# Altium schematic sheet Solar_950_VDC_Standby_PS.SchDoc
size A1; SPICEModelCacheYQEDCYZF: <root> / <DocumentId>YQEDCYZF</DocumentId> / </root>
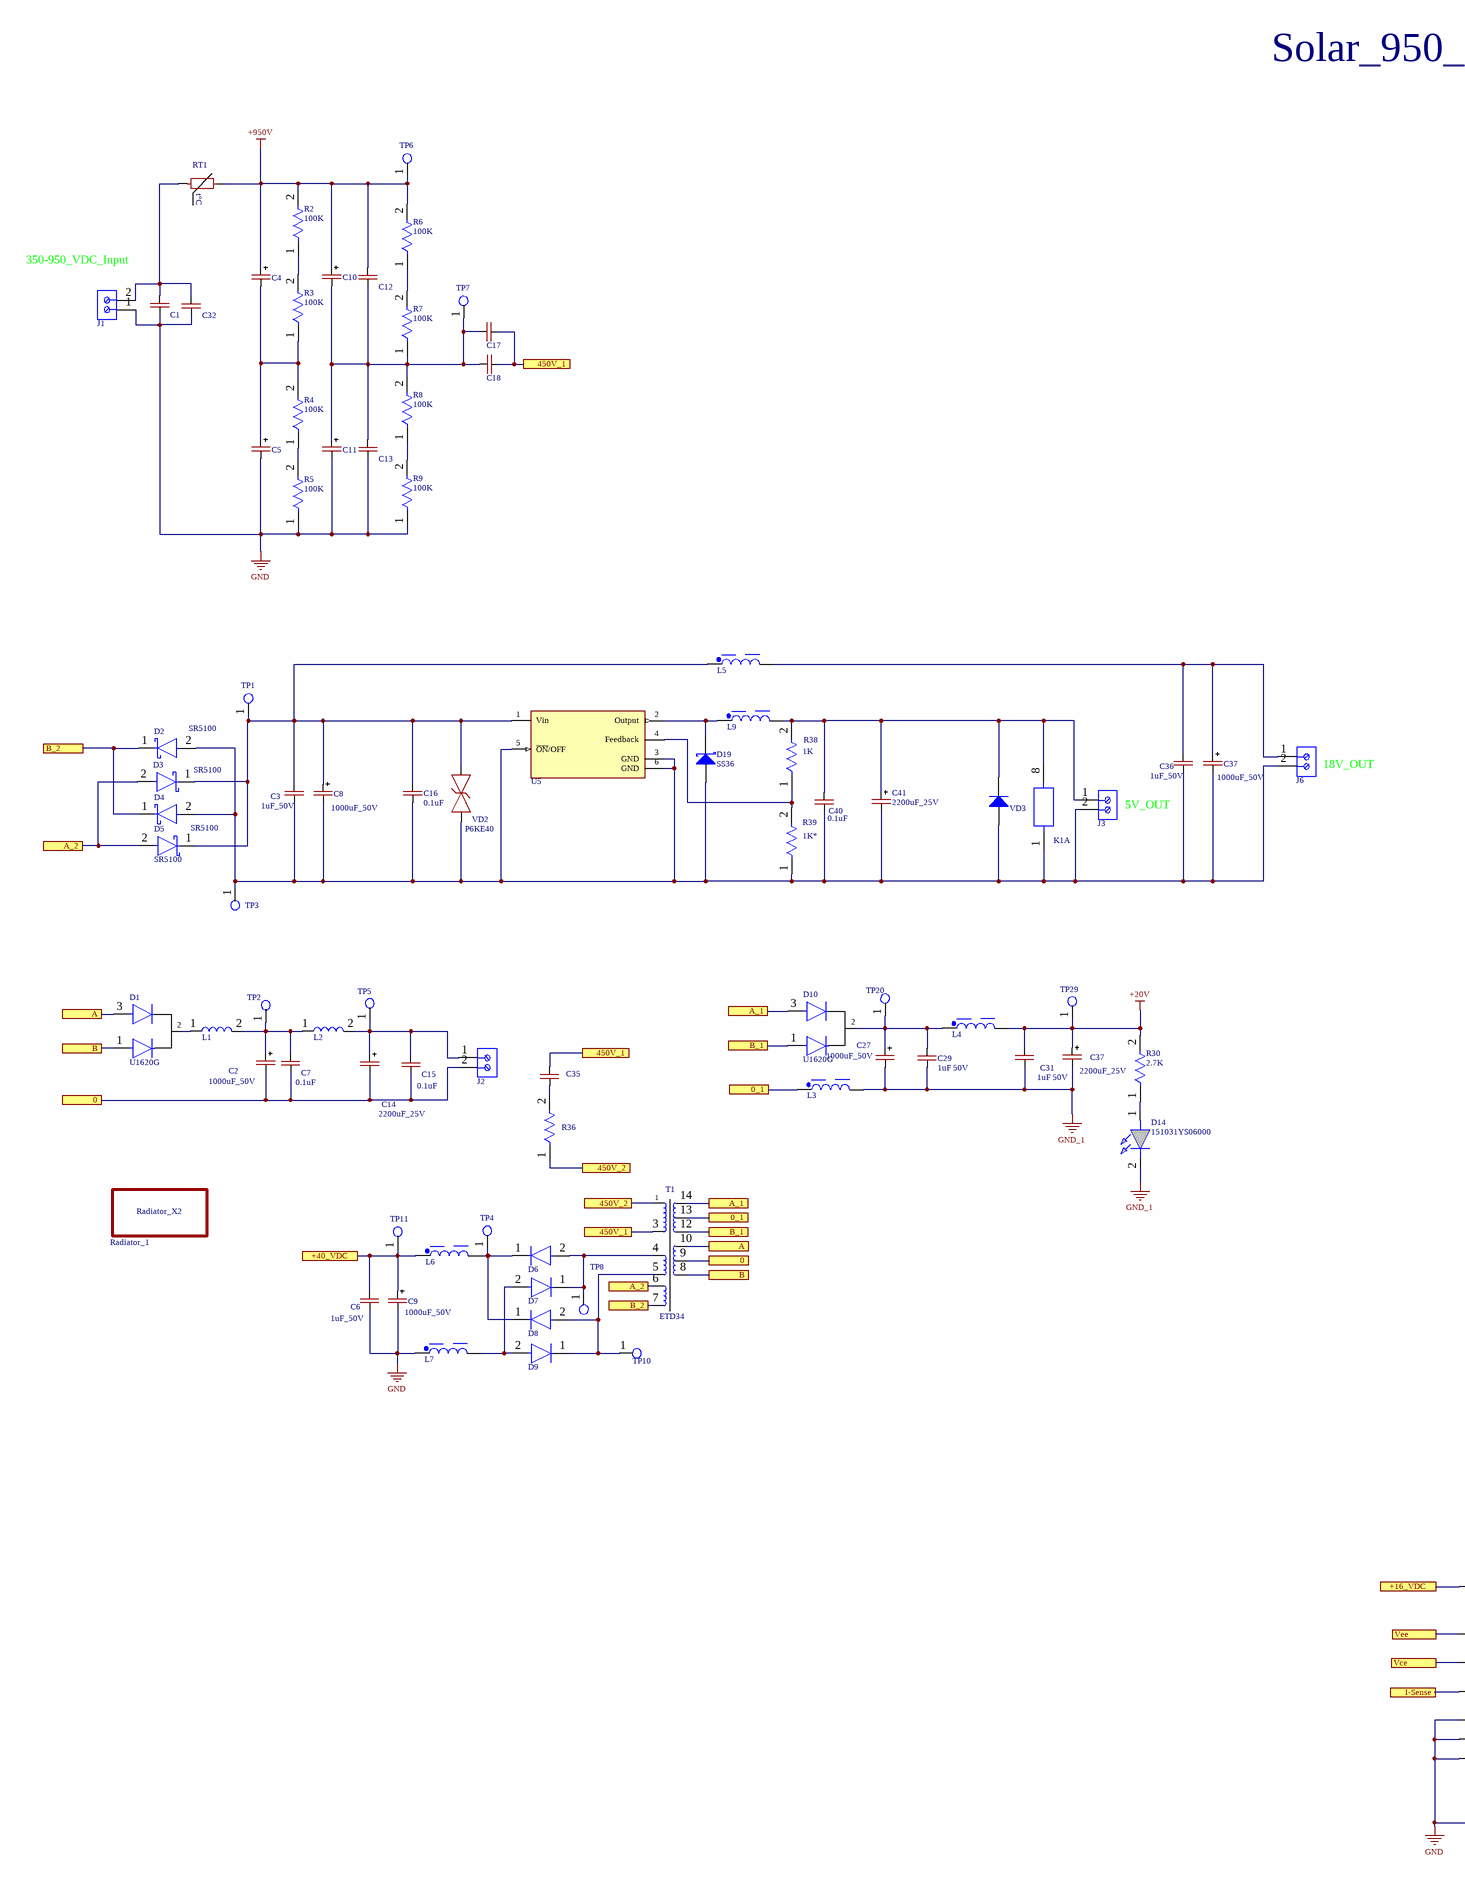
[diagram p0: Solar_950_VDC_Standby_PS.SchDoc, left]
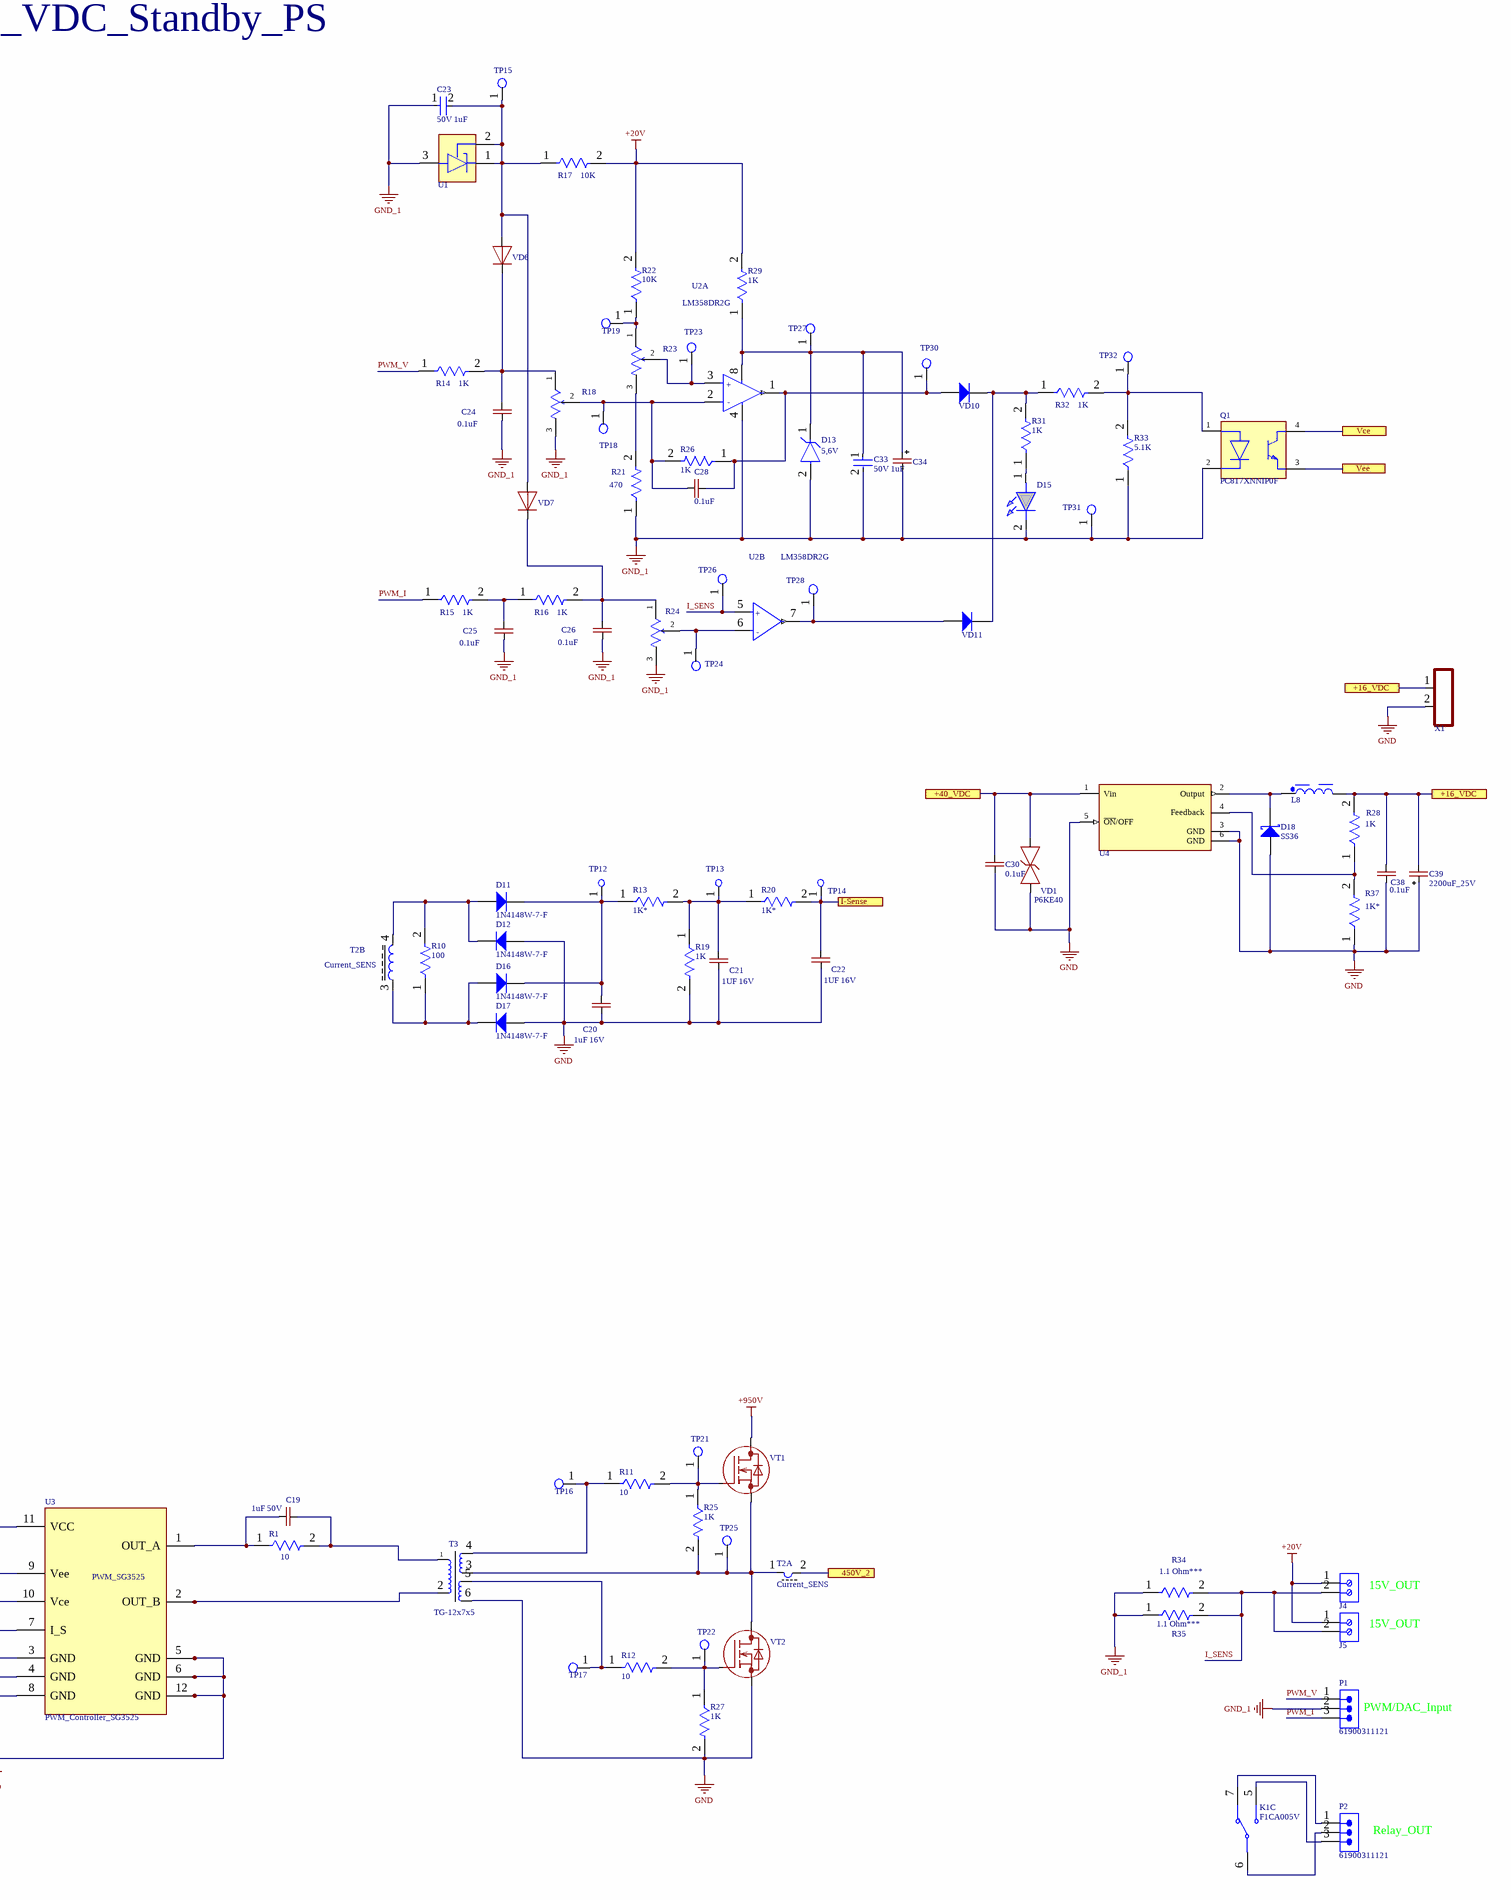
[diagram p1: Solar_950_VDC_Standby_PS.SchDoc, right]

## Parts
(Parts that share a designator on the sheet are numbered #1, #2 ... from top to bottom, then left to right.)
C1  (no value)  [CAP-V]
C2  1000uF_50V  [CAPPOL-12x25]
C3  1uF_50V  [CAP-0805]
C4  CAP-POLAR  [CAP 100uF_500V 22x40mm]  (value not drawn)
C5  CAP-POLAR  [CAP 100uF_500V 22x40mm]  (value not drawn)
C6  1uF_50V  [CAP-0805]
C7  0.1uF  [CAP-0805]
C8  1000uF_50V  [CAPPOL-12x25]
C9  1000uF_50V  [CAPPOL-12x25]
C10  CAP-POLAR  [CAP 100uF_500V 22x40mm]  (value not drawn)
C11  CAP-POLAR  [CAP 100uF_500V 22x40mm]  (value not drawn)
C12  CAP-NON-POLAR  [CAP_3.3uF_630V]  (value not drawn)
C13  CAP-NON-POLAR  [CAP_3.3uF_630V]  (value not drawn)
C14  2200uF_25V  [CAPPOL-12x25]
C15  0.1uF  [CAP-0805]
C16  0.1uF  [CAP-0805]
C17  CAP-NON-POLAR  [CAP_3.3uF_630V]  (value not drawn)
C18  CAP-NON-POLAR  [CAP_3.3uF_630V]  (value not drawn)
C19  1uF 50V  [CAP-0805]
C20  1uF 16V  [CAP-0805]
C21  1UF 16V  [CAP-0805]
C22  1UF 16V  [CAP-0805]
C23  50V 1uF  [FP-C0805C-DN-IPC_A]
C24  0.1uF  [CAP-0805]
C25  0.1uF  [CAP-0805]
C26  0.1uF  [CAP-0805]
C27  1000uF_50V  [CAPPOL-12x25]
C28  0.1uF  [CAP-0805]
C29  1uF 50V  [CAP-0805]
C30  0.1uF  [CAP-0805]
C31  1uF 50V  [CAP-0805]
C32  (no value)  [CAP-V]
C33  50V 1uF  [FP-C0805C-DN-IPC_A]
C34  CAP-POLAR  [CAP-TAN-D]  (value not drawn)
C35  CAP-V  [CAP-V]  (value not drawn)
C36  1uF_50V  [CAP-0805]
C37#1  1000uF_50V  [CAPPOL-12x25]
C37#2  2200uF_25V  [CAPPOL-12x25]
C38  0.1uF  [CAP-0805]
C39  2200uF_25V  [CAP_POL_13x26_1000uF_50V]
C40  0.1uF  [CAP-0805]
C41  2200uF_25V  [CAP_POL_13x26_1000uF_50V]
D1  U1620G  [TO-220(bend1)]
D2  SR5100  [SR5100(DO-201AD]
D3  SR5100  [SR5100(DO-201AD]
D4  SR5100  [SR5100(DO-201AD]
D5  SR5100  [SR5100(DO-201AD]
D6  US1G  [DO-214AA]  (value not drawn)
D7  US1G  [DO-214AA]  (value not drawn)
D8  US1G  [DO-214AA]  (value not drawn)
D9  US1G  [DO-214AA]  (value not drawn)
D10  U1620G  [TO-220(bend1)]
D11  1N4148W-7-F  [DIOD-SOD123-2_V]
D12  1N4148W-7-F  [DIOD-SOD123-2_V]
D13  5,6V  [FP-SB-V-3906_04-031_4-MFG]
D14  151031YS06000  [LED_GREEN]
D15  (no value)  [LED_RED]
D16  1N4148W-7-F  [DIOD-SOD123-2_V]
D17  1N4148W-7-F  [DIOD-SOD123-2_V]
D18  SS36  [SMC/DO214AB]
D19  SS36  [SMC/DO214AB]
J1  691101710002  [691101710002]  (value not drawn)
J2  691101710002  [691101710002]  (value not drawn)
J3  691101710002  [691101710002]  (value not drawn)
J4  (no value)  [691101710002]
J5  691101710002  [691101710002]  (value not drawn)
J6  691101710002  [691101710002]  (value not drawn)
K1  (no value)  [Relay_F1CA005V_Omron]  (parts A,C of 3)
L1  Coil  [Coil-12x7x5(vert)]  (value not drawn)
L2  Coil  [Coil-12x7x5(vert)]  (value not drawn)
L3  1.2µH, 7.4A  [WE-PD2_1054]  (value not drawn)
L4  1.2µH, 7.4A  [WE-PD2_1054]  (value not drawn)
L5  1.2µH, 7.4A  [WE-PD2_1054]  (value not drawn)
L6  1.2µH, 7.4A  [WE-PD2_1054]  (value not drawn)
L7  1.2µH, 7.4A  [WE-PD2_1054]  (value not drawn)
L8  22µH, 2.04A  [WE-PD2_1054]  (value not drawn)
L9  22µH, 2.04A  [WE-PD2_1054]  (value not drawn)
P1  61900311121  [61900311121]
P2  61900311121  [61900311121]
Q1  PC817XNNIP0F  [FP-PC817XNNIP0F-MFG]
R1  10  [RES-2512]
R2  100K  [RES-2512]
R3  100K  [RES-2512]
R4  100K  [RES-2512]
R5  100K  [RES-2512]
R6  100K  [RES-2512]
R7  100K  [RES-2512]
R8  100K  [RES-2512]
R9  100K  [RES-2512]
R10  100  [RES-2512]
R11  10  [RES-0805]
R12  10  [RES-0805]
R13  1K*  [RES-0805]
R14  1K  [RES-0805]
R15  1K  [RES-0805]
R16  1K  [RES-0805]
R17  10K  [RES-0805]
R18  3296W-1-202LF  [Bourns_3296W_MFG]  (value not drawn)
R19  1K  [RES-0805]
R20  1K*  [RES-0805]
R21  470  [RES-0805]
R22  10K  [RES-0805]
R23  3296W-1-202LF  [Bourns_3296W_MFG]  (value not drawn)
R24  3296W-1-202LF  [Bourns_3296W_MFG]  (value not drawn)
R25  1K  [RES-0805]
R26  1K  [RES-0805]
R27  1K  [RES-0805]
R28  1K  [RES-0805]
R29  1K  [RES-0805]
R30  2.7K  [RES-0805]
R31  1K  [RES-0805]
R32  1K  [RES-0805]
R33  5.1K  [RES-0805]
R34  1.1 Ohm***  [RES-2W_2]
R35  1.1 Ohm***  [RES-2W_2]
R36  RES_1210  [RES_SMD_1210_IPC_A]  (value not drawn)
R37  1K*  [RES-0805]
R38  1K  [RES-0805]
R39  1K*  [RES-0805]
Radiator_1  Radiator_X2  [Radiator_X2]  (value not drawn)
RT1  NTC  [NTC]  (value not drawn)
T1  ETD34  [Transformer_ETD34]
T2  Current_SENS  [Current_Sense_13x7x5]  (parts A,B of 2)
T3  TG-12x7x5  [TG_12x7x5]
TP1  (no value)  [Test_Point]
TP2  Test_Point_PCB  [Test_Point]  (value not drawn)
TP3  (no value)  [Test_Point]
TP4  (no value)  [Test_Point]
TP5  Test_Point_PCB  [Test_Point]  (value not drawn)
TP6  (no value)  [Test_Point]
TP7  (no value)  [Test_Point]
TP8  (no value)  [Test_Point]
TP10  (no value)  [Test_Point]
TP11  (no value)  [Test_Point]
TP12  Test_Point_PCB  [Test_Point]  (value not drawn)
TP13  Test_Point_PCB  [Test_Point]  (value not drawn)
TP14  Test_Point_PCB  [Test_Point]  (value not drawn)
TP15  (no value)  [Test_Point]
TP16  (no value)  [Test_Point]
TP17  (no value)  [Test_Point]
TP18  (no value)  [Test_Point]
TP19  (no value)  [Test_Point]
TP20  (no value)  [Test_Point]
TP21  (no value)  [Test_Point]
TP22  (no value)  [Test_Point]
TP23  (no value)  [Test_Point]
TP24  Test_Point_PCB  [Test_Point]  (value not drawn)
TP25  (no value)  [Test_Point]
TP26  Test_Point_PCB  [Test_Point]  (value not drawn)
TP27  Test_Point_PCB  [Test_Point]  (value not drawn)
TP28  Test_Point_PCB  [Test_Point]  (value not drawn)
TP29  (no value)  [Test_Point]
TP30  Test_Point_PCB  [Test_Point]  (value not drawn)
TP31  Test_Point_PCB  [Test_Point]  (value not drawn)
TP32  Test_Point_PCB  [Test_Point]  (value not drawn)
U1  (no value)  [TL431_SOT-23-3(A)]
U2  LM358DR2G  [FP-751-07-IPC_C]  (parts A,B of 2)
U3  PWM_Controller_SG3525  [PWM_SG3525]
U4  (no value)  [ON_Semiconductor_936A-02_MFG]
U5  (no value)  [ON_Semiconductor_936A-02_MFG]
VD1  P6KE40  [P6KE350CA]
VD2  P6KE40  [P6KE350CA]
VD3  (no value)  [DIOD-SOD123-2_V]
VD6  DIODE  [SOD-123]  (value not drawn)
VD7  DIODE  [SOD-123]  (value not drawn)
VD10  (no value)  [DIOD-SOD123-2_V]
VD11  (no value)  [DIOD-SOD123-2_V]
VT1  MOSFET-N-GDS  [TO-220(bend1)]  (value not drawn)
VT2  MOSFET-N-GDS  [TO-220(bend1)]  (value not drawn)
X1  CONN-2-PIN  [XH2-]  (value not drawn)

## Ports
0, 0_1, 450V_1, 450V_2, +16_VDC, +40_VDC, A, A_1, A_2, B, B_1, B_2, I-Sense, Vce, Vee

## Nets
+20V: C31.2 C37#2.1(+) J4.1 J5.1 L4.2 R17.2 R22.2 R29.2 R30.2 TP29.1(G9)
+950V: C4.1(+) C10.1(+) C12.2 R2.2 R6.2 RT1.2 TP6.1(G9) VT1.2(D)
GND: C1.1 C5.2(-) C6.2 C9.2(-) C11.2(-) C13.1 C20.1 C21.1 C22.1 C30.1 C32.1 C38.1 C39.1(+) D12.2(A) D17.2(A) D18.2(A) J1.1 L7.1 R5.1 R9.1 R19.2 R27.2 R37.1 T3.6 U3.3(GND) U3.4(GND) U3.5(GND) U3.6(GND) U3.8(GND) U3.12(GND) U4.3(GND) U4.5(~{ON}/OFF) U4.6(GND) VD1.1(C) VT2.3(S) X1.2
GND_1: C23.1 C24.1 C25.1 C26.1 C27.2(-) C29.1 C31.1 C33.2 C34.2(-) C37#2.2(-) D13.2(A) D14.2(K) D15.2(K) L3.2 P1.2 Q1.2(C) R18.3(CW) R21.1 R24.3(CW) R33.1 R34.1 R35.1 TP31.1(G9) U1.3(A) U2.4(VEE/GND)
0: C2.2(-) C7.1 C14.2(-) C15.1 J2.2 T1.9 ; port 0
0_1: L3.1 T1.13 ; port 0_1
450V_1: C17.1 C18.2 C35.2 T1.3 ; port 450V_1
450V_2: R36.1 T1.1 T2.2 ; port 450V_2
+16_VDC: C38.2 C39.2(-) L8.2 R28.2 U3.11(VCC) X1.1 ; port +16_VDC
+40_VDC: C6.1 C9.1(+) C30.2 L6.1 TP11.1(G9) U4.1(Vin) VD1.2(A) ; port +40_VDC
A: D1.3(A) T1.10 ; port A
A_1: D10.3(A) T1.14 ; port A_1
A_2: D3.2(A) D5.2(A) T1.6 ; port A_2
B: D1.1(A) T1.8 ; port B
B_1: D10.1(A) T1.12 ; port B_1
B_2: D2.1(C) D4.1(C) T1.7 ; port B_2
I-Sense: C22.2 R20.2 TP14.1(G9) U3.7(I_S) ; port I-Sense
I_SENS: J4.2 J5.2 R34.2 R35.2 TP26.1(G9) U2.5(INPUT_B+)
PWM_I: P1.3 R15.1
PWM_V: P1.1 R14.1
Vce: Q1.4(C) U3.10(Vce) ; port Vce
Vee: Q1.3(E) U3.9(Vee) ; port Vee
NetC1_2: C1.2 C32.2 J1.2 RT1.1
NetC2_1: C2.1(+) C7.2 L1.2 L2.1 TP2.1(G9)
NetC3_1: C3.1 C8.1(+) C16.2 D3.1(C) D5.1(C) L5.1 TP1.1(G9) U5.1(Vin) VD2.2(A)
NetC3_2: C3.2 C8.2(-) C16.1 C36.2 C37#1.2(-) C40.1 C41.2(-) D2.2(A) D4.2(A) D19.2(A) J3.2 J6.2 K1.1 R39.1 TP3.1(G9) U5.3(GND) U5.5(~{ON}/OFF) U5.6(GND) VD2.1(C) VD3.2(A)
NetC4_2: C4.2(-) C5.1(+) R3.1 R4.2
NetC10_2: C10.2(-) C11.1(+) C12.1 C13.2 C17.2 C18.1 R7.1 R8.2 TP7.1(G9)
NetC14_1: C14.1(+) C15.2 J2.1 L2.2 TP5.1(G9)
NetC19_1: C19.1 R1.2 T3.1
NetC19_2: C19.2 R1.1 U3.1(OUT_A)
NetC20_2: C20.2 D11.1(K) D16.1(K) R13.1 TP12.1(G9)
NetC21_2: C21.2 R13.2 R19.1 R20.1 TP13.1(G9)
NetC23_2: C23.2 R17.1 TP15.1(G9) U1.1(C) U1.2(REF) VD6.2(A) VD7.2(A)
NetC24_2: C24.2 R14.2 R18.1(CCW) VD6.1(C)
NetC25_2: C25.2 R15.2 R16.1
NetC26_2: C26.2 R16.2 R24.1(CCW) VD7.1(C)
NetC27_1: C27.1(+) C29.2 D10.2(C) L4.1 TP20.1(G9)
NetC28_1: C28.1 R26.1 TP30.1(G9) U2.1(OUTPUT_A) VD10.2(A)
NetC28_2: C28.2 R18.2(WIPER) R26.2 TP18.1(G9) U2.2(INPUT_A-)
NetC33_1: C33.1 C34.1(+) D13.1(C) R29.1 TP27.1(G9) U2.8(VCC)
NetC35_1: C35.1 R36.2
NetC36_1: C36.1 C37#1.1(+) J6.1 L5.2
NetC40_2: C40.2 C41.1(+) J3.1 K1.8 L9.2 R38.2 VD3.1(K)
NetD1_2: D1.2(C) L1.1
NetD6_1: D6.1(C) D8.1(C) L6.2 TP4.1(G9)
NetD6_2: D6.2(A) D7.1(C) T1.4 TP8.1(G9)
NetD7_2: D7.2(A) D9.2(A) L7.2
NetD8_2: D8.2(A) D9.1(C) T1.5 TP10.1(G9)
NetD11_2: D11.2(A) D12.1(K) R10.2 T2.4
NetD14_1: D14.1(A) R30.1
NetD15_1: D15.1(A) R31.1
NetD16_2: D16.2(A) D17.1(K) R10.1 T2.3
NetD18_1: D18.1(K) L8.1 U4.2(Output)
NetD19_1: D19.1(K) L9.1 U5.2(Output)
NetK1_5: K1.5 P2.3
NetK1_6: K1.6 P2.2
NetK1_7: K1.7 P2.1
NetQ1_1: Q1.1(A) R32.2 R33.2 TP32.1(G9)
NetR2_1: R2.1 R3.2
NetR4_1: R4.1 R5.2
NetR6_1: R6.1 R7.2
NetR8_1: R8.1 R9.2
NetR11_1: R11.1 T3.4 TP16.1(G9)
NetR11_2: R11.2 R25.1 TP21.1(G9) VT1.1(G)
NetR12_1: R12.1 T3.5 TP17.1(G9)
NetR12_2: R12.2 R27.1 TP22.1(G9) VT2.1(G)
NetR21_2: R21.2 R23.3(CW)
NetR22_1: R22.1 R23.1(CCW) TP19.1(G9)
NetR23_2: R23.2(WIPER) TP23.1(G9) U2.3(INPUT_A+)
NetR24_2: R24.2(WIPER) TP24.1(G9) U2.6(INPUT_B-)
NetR25_2: R25.2 T2.1 T3.3 TP25.1(G9) VT1.3(S) VT2.2(D)
NetR28_1: R28.1 R37.2 U4.4(Feedback)
NetR31_2: R31.2 R32.1 VD10.1(K) VD11.1(K)
NetR38_1: R38.1 R39.2 U5.4(Feedback)
NetT3_2: T3.2 U3.2(OUT_B)
NetTP28_1: TP28.1(G9) U2.7(OUTPUT_B) VD11.2(A)

## Notes on the sheet
- Solar_950_VDC_Standby_PS
- 350-950_VDC_Input
- (near J6) 18V_OUT
- 5V_OUT
- 15V_OUT
- (near P1) PWM/DAC_Input
- (near P2) Relay_OUT
- (in symbol CMP-1310-00291-2, part A) +; -
- (in symbol CMP-1310-00291-2, part B) +; -
- (in symbol NTC) t°C
- (in symbol PWM_Controller_SG3525) PWM_SG3525

## Library data of the parts
C1 C32 = CAP-V
C2 C14 C27 C37#2 = CAP-POLAR
C3 C6 C7 C15 C16 C19-C22 C24-C26 C28-C31 C36 C38 C40 = CAP-NON-POLAR
C8 C9 C37#1 = CAP-POLAR: 1000uF_50V  12x25(13x26mm)
C23 C33 = CMP-1036-04552-2: CAP CER 0.22UF 50V X7R 0805; Manufacturer: KEMET; Manufacturer Part Number: C0805C224K5RACTU; Value: 0.22 μF; Temperature Coefficient: 30ppm/°C; Material: Ceramic; Tolerance: 0.1; ComponentLink2URL: https://content.kemet.com/datasheets/KEM_C1003_C0G_SMD.pdf; Temperature Characteristic: X7R; Device Class L3: Ceramic Capacitors; Lead Free: Yes; Temperature: -55°C to +125°C; RoHS: TRUE; Capacitance: 0.22 μF; Automotive: No; Octopart: https://octopart.com/c0805c224k5ractu-kemet-144670; Temperature Range Low: -55°C; Height: 0.88mm; Device Class L1: Passive Components; Digikey Description: CAP CER 0.22UF 50V X7R 0805; ComponentLink2Description: Datasheet; Mouser Description: CAP CER 0.22UF 50V X7R 0805; Category: Cap; Ipc Land Pattern Name: CAPC200125X78; Temperature Range High: +125°C; Package: C0805C-DN; Device Class L2: Capacitors; Voltage Rating: 50 V
C39 C41 = CAP_polar_Hitano
D11 D12 D16 D17 VD3 VD10 VD11 = 1N4148: Fast Switching Diode, 100 V, 0.15 A, -65 to 150 degC, 2-Pin?SOD123, RoHS, Tape and Reel; Recovery Time: 4ns; Brand: DiodesIncorporated; Unit Weight: 0.000353oz; Max Surge Current: 2A; Peak Reverse Voltage: 100V; Ir - Reverse Current: 1uA; Vf - Forward Voltage: 1.25V; Configuration: Single; If - Forward Current: 0.15A; Product Category: Diodes-GeneralPurpose,Power,Switching; Operating Temperature Range: -65Cto+150C; Packaging: Reel; Manufacturer URL: http://www.diodes.com/; Maximum Operating Temperature: +150C; Height: 1.25mm; Minimum Operating Temperature: -65C; Product: SwitchingDiodes; Package URL: http://www.diodes.com/datasheets/ds18004.pdf; Type: SwitchingDiode; Package Reference: SOD123-2; Width: 1.7mm; Datasheet URL: http://www.farnell.com/datasheets/1915529.pdf; Datasheet Version: Rev. 24-2, 10/2013; Series: 1N4148; Factory Pack Quantity: 3000; Length: 2.85mm; RoHS: True; Manufacturer: DiodesIncorporated; Mounting Style: SMD/SMT; Package / Case: SOD-123
D13 = CMP-02541-000026-1: DIODE ZENER 8.2V 500MW DO35; Test Current: 5mA; Tolerance: 2%; Impedance: 7R; ESD Protection: No; Element Configuration: Single; Max Reverse Leakage Current: 100nA; Packaging: Ammo Pack; Case/Package: DO-35; Lead Free: Lead Free; Number of Pins: 2; Min Operating Temperature: -65°C; Contact Plating: Tin; Max Power Dissipation: 500mW; Radiation Hardening: No; Max Operating Temperature: 175°C; Mount: Through Hole; Package Quantity: 30000; Voltage Tolerance: 2%; Series: Automotive, AEC-Q101; Zener Voltage: 8.2V; RoHS Compliant: Yes; Power Dissipation: 500mW
D14 D15 = LED: WURTH ELEKTRONIK - 151031YS06000 - LED, Yellow, Through Hole, T-1 (3mm), 30 mA, 2 V, 590 nm; Geometry.Height: 5.5mm; Manufacturer_Name: Wurth Elektronik; Manufacturer_Part_Number: 151031YS06000; Mouser Part Number: 710-151031YS06000; Mouser Price/Stock: https://www.mouser.co.uk/ProductDetail/Wurth-Elektronik/151031YS06000?qs=LlUlMxKIyB3xSYYW%252BcuBiQ%3D%3D; Arrow Part Number: *; Arrow Price/Stock: *; Mouser Testing Part Number: *; Mouser Testing Price/Stock: *; Datasheet Link: https://katalog.we-online.de/led/datasheet/151031YS06000.pdf
D18 D19 = SS36_Schottky
J1-J6 = 691101710002: WR-TBL Series 101 Horizontal Entry Modular, THT, pitch 5mm, 2p; Manufacturer: Wurth Elektronik; Modularity: Yes; Rated Current: 16A; Working Voltage: 250V; ComponentLink1Description: Website Link; ComponentLink1URL: https://www.we-online.com/redexpert/article/691101710002?ad; ComponentLink2Description: Datasheet Link; ComponentLink2URL: https://www.we-online.com/redexpert/spec/691101710002?ad; Manufacturer Part Number: 691101710002; Category: Terminal Blocks; Match Code: WR-TBL; Mount: Through Hole; Operating Temperature Max: 105°C; Operating Temperature Min: -40°C; Packaging: Box; Application: Pressure Clamp; Number of Pins: 2; Number of Rows: 1; Orientation: Horizontal; Pitch: 5mm
K1 = F1CA005V
L3-L7 = 744776012: WE-PD2 SMT Power Inductor, size 1054, 1.2µH, 7.4A, 0.006Ω; Manufacturer: Wurth Elektronik; Case/Size Code: 1054; DC Resistance: 0.004Ω; Saturation Current: 11A; Self Resonant Frequency: 110MHz; Manufacturer Part Number: 744776012; Category: Unshielded Power Inductors; Match Code: WE-PD2; ComponentLink1Description: Website Link; ComponentLink1URL: https://www.we-online.com/redexpert/article/744776012?ad; ComponentLink2Description: Datasheet Link; ComponentLink2URL: https://www.we-online.com/redexpert/spec/744776012?ad; Mount: Surface Mount; Operating Temperature Max: 125°C; Operating Temperature Min: -40°C; Packaging: Tape and Reel; Length: 10mm; Width: 9mm; Height: 5.4mm; DC Resistance Max: 0.006Ω; Inductance: 1.2µH; Rated Current: 7.4A
L8 L9 = 744776122: WE-PD2 SMT Power Inductor, size 1054, 22µH, 2.04A, 0.1Ω; Manufacturer: Wurth Elektronik; Case/Size Code: 1054; DC Resistance: 0.051Ω; Saturation Current: 2.07A; Self Resonant Frequency: 16MHz; Manufacturer Part Number: 744776122; Category: Unshielded Power Inductors; Match Code: WE-PD2; ComponentLink1Description: Website Link; ComponentLink1URL: https://www.we-online.com/redexpert/article/744776122?ad; ComponentLink2Description: Datasheet Link; ComponentLink2URL: https://www.we-online.com/redexpert/spec/744776122?ad; Mount: Surface Mount; Operating Temperature Max: 125°C; Operating Temperature Min: -40°C; Packaging: Tape and Reel; Length: 10mm; Width: 9mm; Height: 5.4mm; DC Resistance Max: 0.1Ω; Inductance: 22µH; Rated Current: 2.04A
P1 P2 = 61900311121: WR-WTB THT Male Vertical Locking Header, pitch 2.54mm, 3pins; Manufacturer: Wurth Elektronik; Contact Resistance: 20mΩ; Rated Current: 3A; Withstanding Voltage: 1000VAC; Working Voltage: 250VAC; ComponentLink1Description: Website Link; ComponentLink1URL: https://www.we-online.com/redexpert/article/61900311121?ad; ComponentLink2Description: Datasheet Link; ComponentLink2URL: https://www.we-online.com/redexpert/spec/61900311121?ad; Pitch: 2.54mm; Packaging: Bag; Gender: Male; Manufacturer Part Number: 61900311121; Category: Wire-to-Board Connectors; Match Code: WR-WTB; Mount: Through Hole; Operating Temperature Max: 105°C; Operating Temperature Min: -40°C; Length: 7.62mm; Width: 5.8mm; Height: 11.5mm; Number of Pins: 3; Number of Rows: 1; Orientation: Vertical
Q1 = CMP-65434-000005-1: OPTOISOLATOR 5KV TRANS 4SMD; Reverse Breakdown Voltage: 6V; Output Current per Channel: 30mA; Power Dissipation: 200mW; Collector-emitter Voltage-Max: 200mV; Max Output Voltage: 80V; Input Current: 50mA; Forward Voltage: 1.4V; Fall Time: 18000ns; Number of Elements: 1; Input Type: DC; Packaging: Tape and Reel; RoHS Compliant: Yes; Contact Plating: Copper; Min Operating Temperature: -30°C; Collector Emitter Saturation Voltage: 200mV; Max Input Current: 50mA; Radiation Hardening: No; Max Collector Current: 50mA; Case/Package: SMD/SMT; Mount: Surface Mount; Output Voltage: 80V; Forward Current: 50mA; Max Power Dissipation: 200mW; Collector Emitter Voltage (VCEO): 80V; Number of Channels: 1; Rise Time: 18000ns; Isolation Voltage: 5kV; Number of Pins: 4; Lead Free: Lead Free; Package Quantity: 2000; Isolation Voltage-Max: 5kV; Max Operating Temperature: 100°C
R1 R11 R12 R37 R39 = RES-CONST: 1K
R2-R9 = RES-CONST: 500K
R10 R13-R17 R19-R21 R25-R33 R38 = RES-CONST
R22 = RES-CONST: 1-K
R34 R35 = RES-CONST: 10K
TP1-TP8 TP10-TP32 = TP_PCB?: Test_Point
U1 = TL431_SOT-23-3
U2 = CMP-1310-00291-2: IC OPAMP GP 2 CIRCUIT 8SOIC; Gain Bandwidth Product: 1MHz; Number of Circuits: 2; Min Supply Voltage: 3V; Slew Rate: 0.6V/µs; Max Dual Supply Voltage: 16V; Common Mode Rejection Ratio: 65dB; Input Bias Current: 250nA; Min Dual Supply Voltage: 1.5V; Dual Supply Voltage: 9V; Operating Supply Current: 1.5mA; Output Current: 40mA; Input Offset Voltage (Vos): 7mV; Nominal Supply Current: 1.2mA; Voltage Gain: 100dB; Max Supply Voltage: 32V; Width: 4mm; Number of Pins: 8; Min Operating Temperature: 0°C; REACH SVHC: No SVHC; Contact Plating: Tin; Lead Free: Lead Free; Halogen Free: Halogen Free; Power Supply Rejection Ratio (PSRR): 65dB; Operating Supply Voltage: 16V; Package Quantity: 2500; Max Operating Temperature: 70°C; Case/Package: SOIC; Height: 1.5mm; Packaging: Tape and Reel; Radiation Hardening: No; Number of Channels: 2; Bandwidth: 1MHz; Length: 5mm; Number of Elements: 2; Number of Amplifiers: 2; Output Current per Channel: 40mA
U4 U5 = LM2576D2T-005G
VD1 VD2 = Suppressor